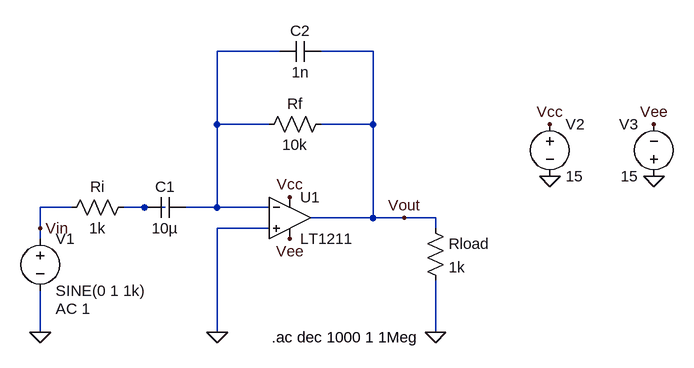
[diagram p0: schematic First Order Active BPF.asc]
First Order Active BPF.asc, the LTspice schematic file:
Version 4
SHEET 1 880 680
WIRE 128 -96 32 -96
WIRE 272 -96 192 -96
WIRE 32 16 32 -96
WIRE 112 16 32 16
WIRE 272 16 272 -96
WIRE 272 16 192 16
WIRE -192 144 -240 144
WIRE -80 144 -112 144
WIRE -48 144 -80 144
WIRE 32 144 32 16
WIRE 32 144 -16 144
WIRE 112 144 32 144
WIRE 272 160 272 16
WIRE 272 160 176 160
WIRE 320 160 272 160
WIRE 368 160 320 160
WIRE -240 176 -240 144
WIRE 112 176 32 176
WIRE 368 176 368 160
WIRE -240 192 -240 176
WIRE -240 336 -240 272
WIRE 32 336 32 176
WIRE 368 336 368 256
FLAG -240 336 0
FLAG 32 336 0
FLAG 368 336 0
FLAG 544 96 0
FLAG 704 96 0
FLAG 544 16 Vcc
FLAG 704 16 Vee
FLAG 144 128 Vcc
FLAG 144 192 Vee
FLAG -240 176 Vin
FLAG 320 160 Vout
SYMBOL OpAmps\\LT1211 144 96 R0
SYMATTR InstName U1
SYMBOL res -96 128 R90
WINDOW 0 0 56 VBottom 2
WINDOW 3 32 56 VTop 2
SYMATTR InstName Ri
SYMATTR Value 1k
SYMBOL res 352 160 R0
SYMATTR InstName Rload
SYMATTR Value 1k
SYMBOL voltage -240 176 R0
WINDOW 123 24 124 Left 2
WINDOW 39 0 0 Left 0
SYMATTR InstName V1
SYMATTR Value SINE(0 1 1k)
SYMATTR Value2 AC 1
SYMBOL voltage 544 0 R0
WINDOW 123 0 0 Left 0
WINDOW 39 0 0 Left 0
SYMATTR InstName V2
SYMATTR Value 15
SYMBOL voltage 704 112 R180
WINDOW 0 24 96 Left 2
WINDOW 3 24 16 Left 2
WINDOW 123 0 0 Left 0
WINDOW 39 0 0 Left 0
SYMATTR InstName V3
SYMATTR Value 15
SYMBOL res 208 0 R90
WINDOW 0 0 56 VBottom 2
WINDOW 3 32 56 VTop 2
SYMATTR InstName Rf
SYMATTR Value 10k
SYMBOL cap -16 128 R90
WINDOW 0 0 32 VBottom 2
WINDOW 3 32 32 VTop 2
SYMATTR InstName C1
SYMATTR Value 10µ
SYMBOL cap 192 -112 R90
WINDOW 0 0 32 VBottom 2
WINDOW 3 32 32 VTop 2
SYMATTR InstName C2
SYMATTR Value 1n
TEXT 116 344 Left 2 !.ac dec 1000 1 1Meg

The netlist it stands for:
* First Order Active BPF.asc
XU1 0 N001 Vcc Vee Vout LT1211  ; pins In+ In- V+ V- OUT
Ri N002 Vin 1k
Rload Vout 0 1k
V1 Vin 0 SINE(0 1 1k) AC 1
V2 Vcc 0 15
V3 0 Vee 15
Rf Vout N001 10k
C1 N001 N002 10µ
C2 Vout N001 1n
.ac dec 1000 1 1Meg
.lib LTC.lib
.backanno
.end